# Altium schematic sheet Sheet_1_2022-03-14.schdoc
size 55 x 35 mm
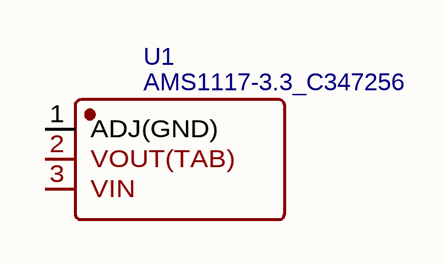
[diagram p0: Sheet_1_2022-03-14.schdoc]

## Parts
U1  AMS1117-3.3_C347256  [SOT-89_L4.5-W2.5-P1.50-LS4.2-BR]

## Nets

Not connected (* = marked no-connect by the designer): U1 1(ADJ(GND)) 2(VOUT(TAB)) 3(VIN)

## Library data of the parts
U1 = AMS1117-3.3_C347256: BOM_Manufacturer: Youtai Semiconductor Co., Ltd.; Contributor: LCSC; BOM_Supplier: LCSC; BOM_Supplier Part: C347256; BOM_Manufacturer Part: AMS1117-3.3; BOM_JLCPCB Part Class: Extended Part; spicePre: U; spiceSymbolName: AMS1117-3.3_C347256